# Altium schematic sheet Logger.SchDoc
size A1; SheetNumber: 1; SheetTotal: 4
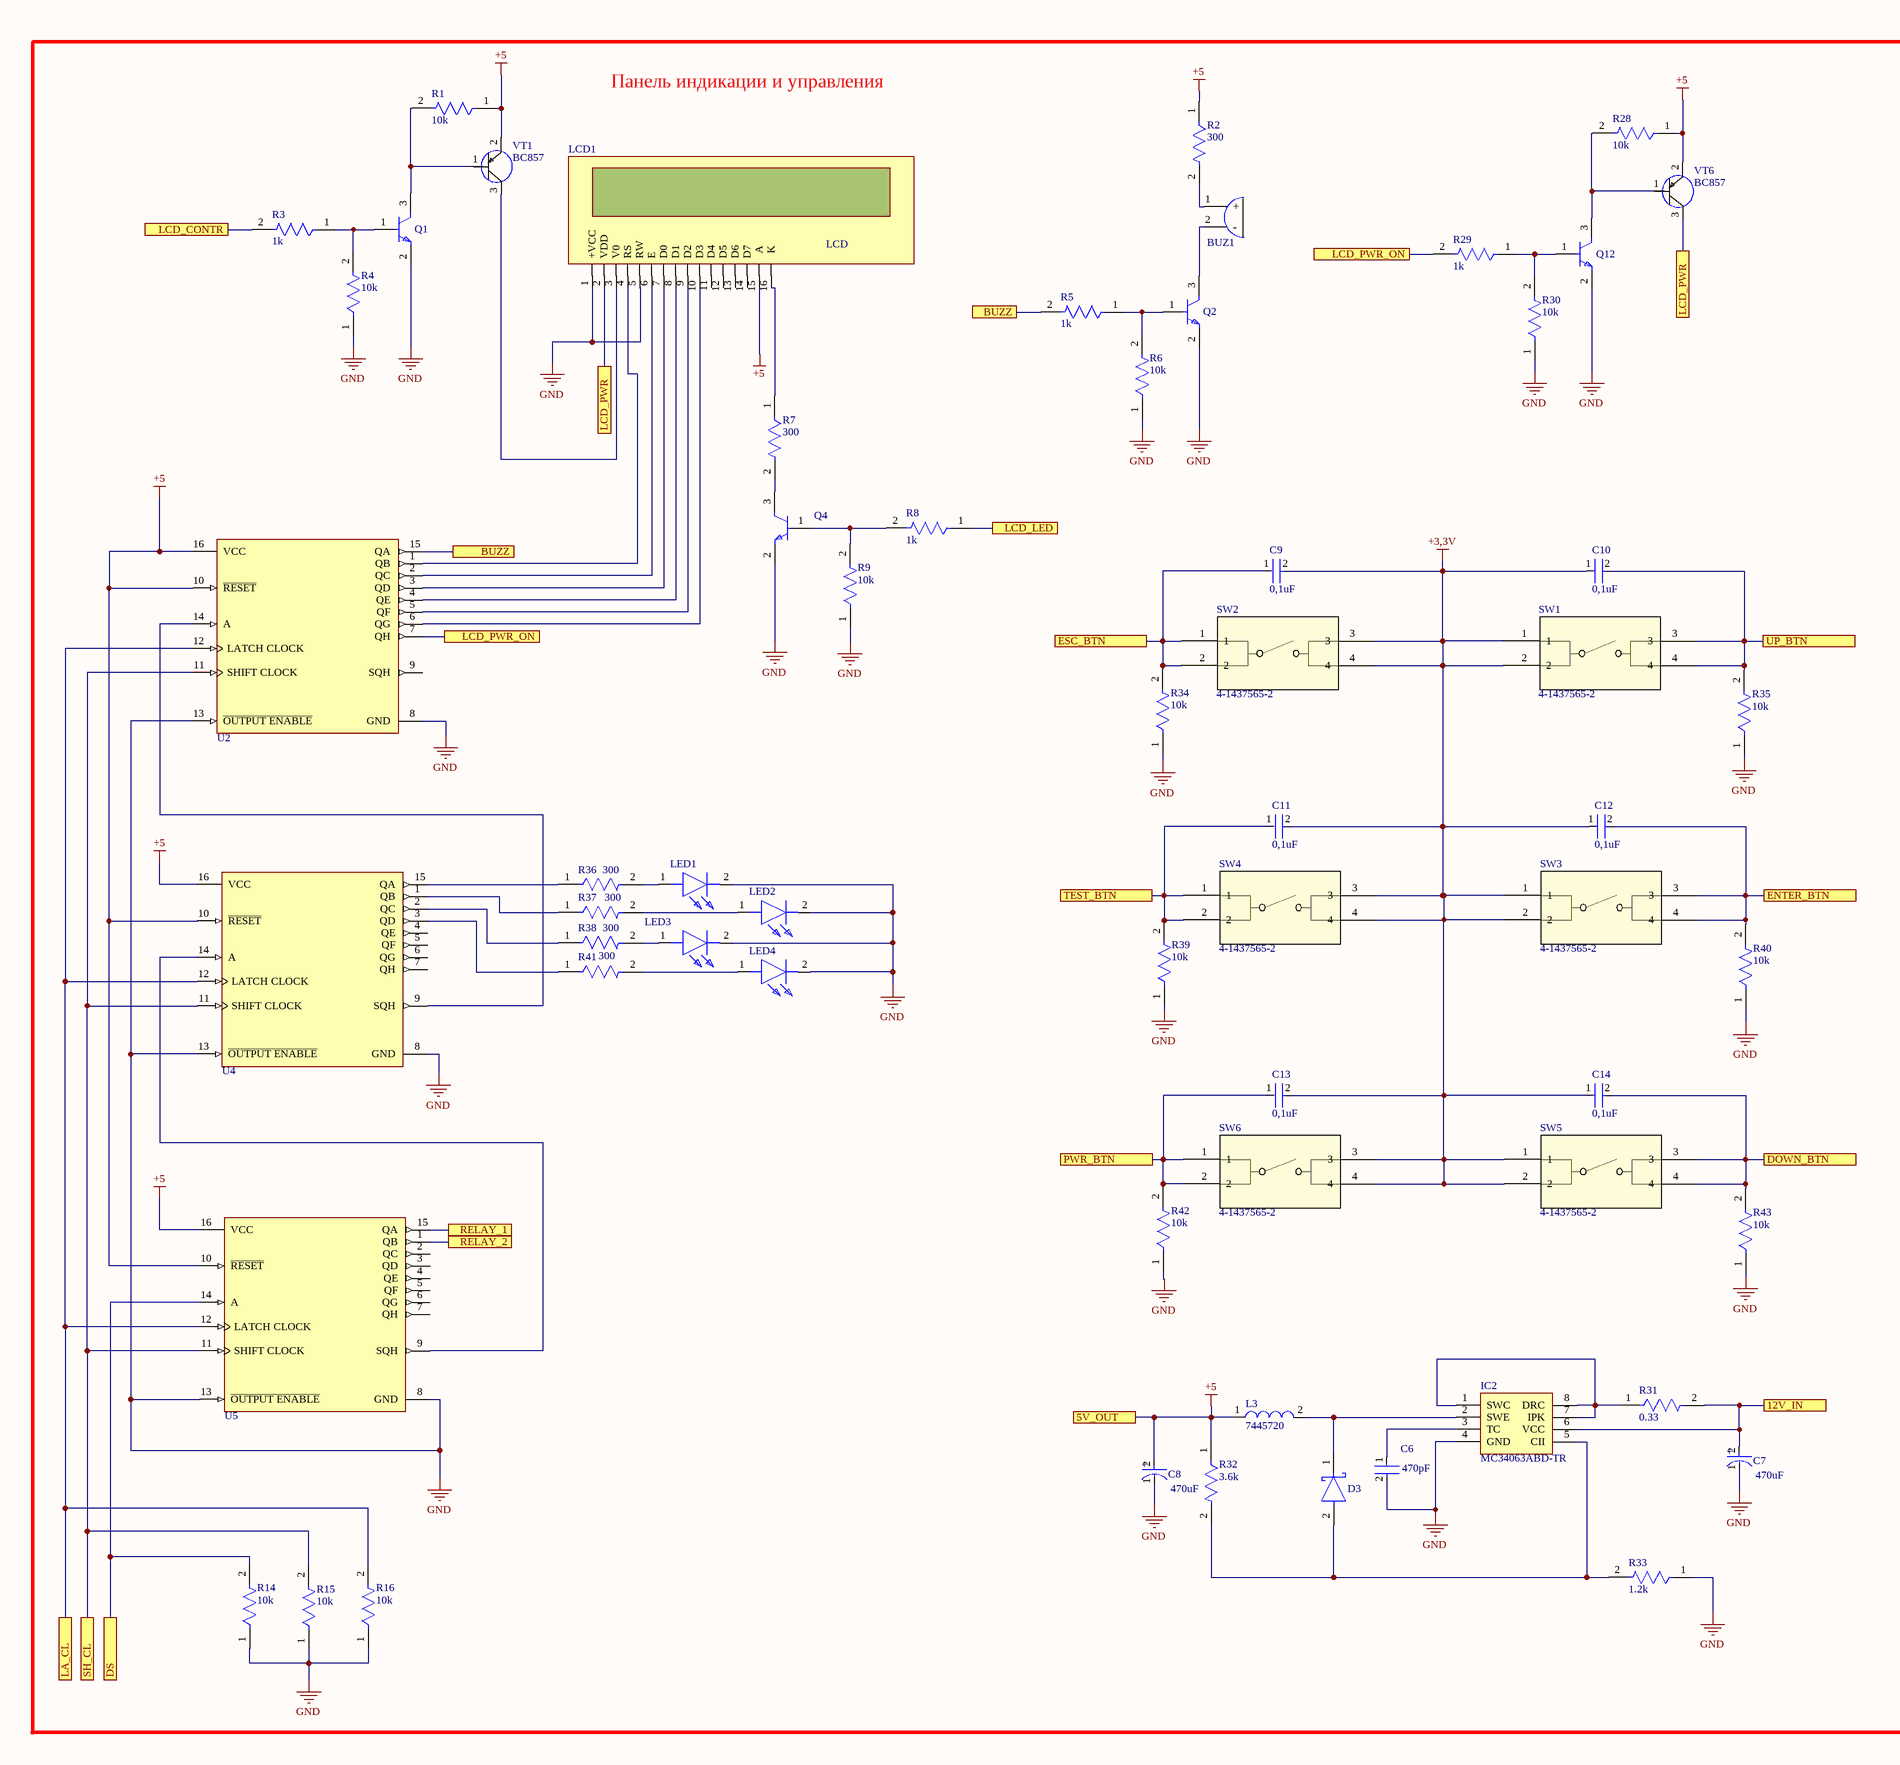
[diagram p0: Logger.SchDoc, left]
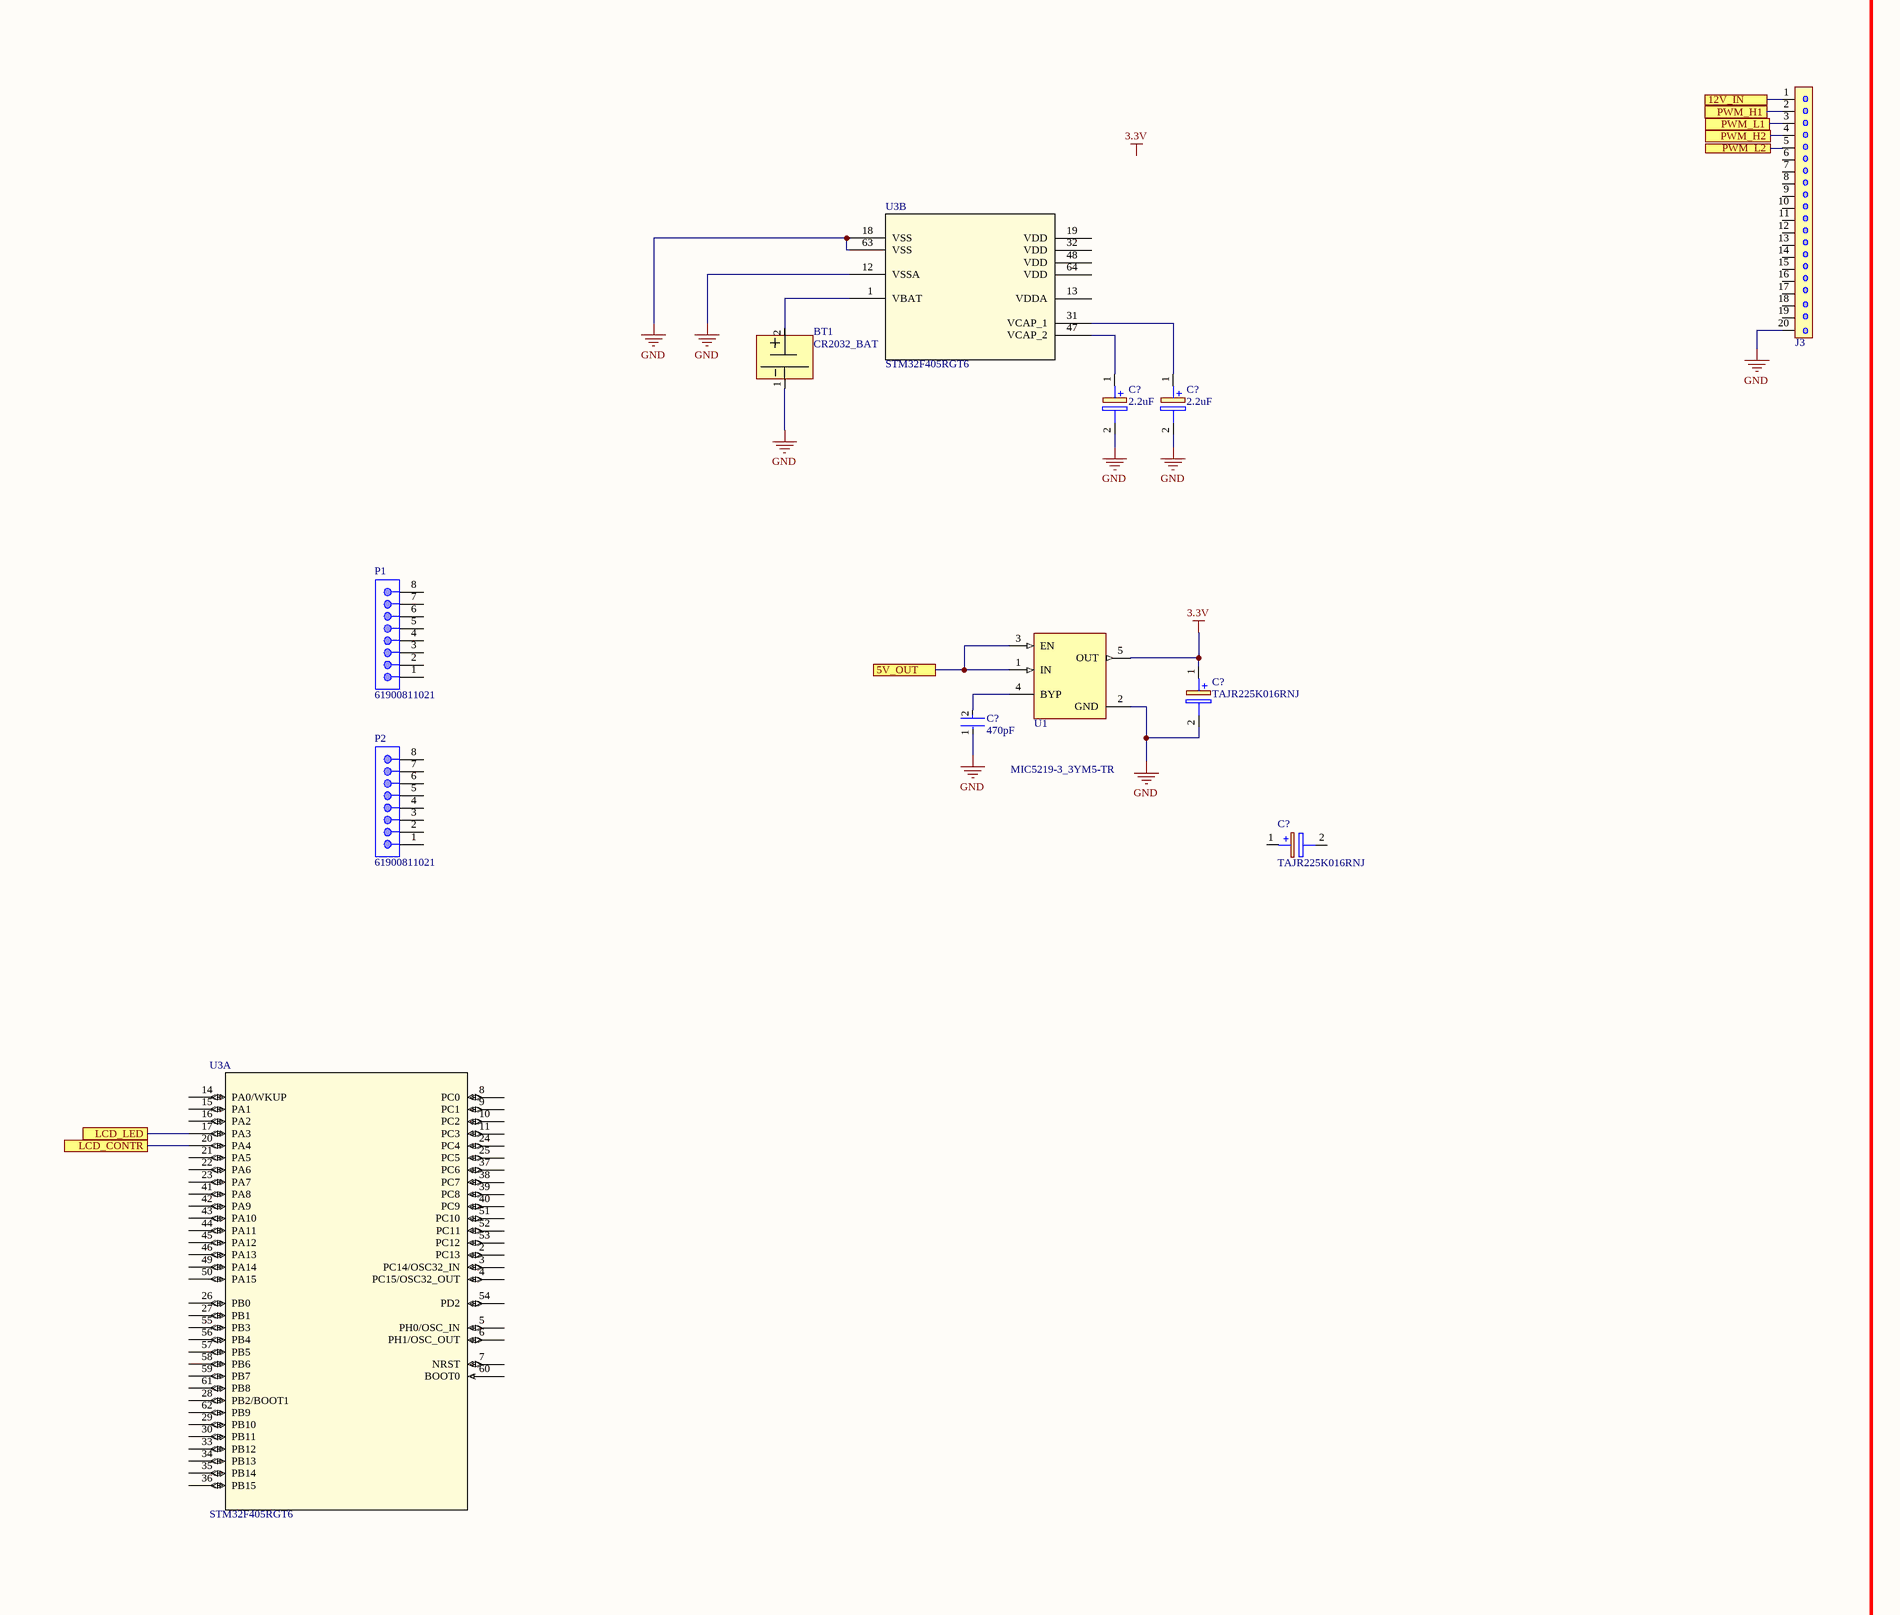
[diagram p1: Logger.SchDoc, right]

## Parts
(Parts that share a designator on the sheet are numbered #1, #2 ... from top to bottom, then left to right.)
BT1  CR2032_BAT  [CR2032_BAT]
BUZ1  BUZZER  [BUZZER]  (value not drawn)
C6  470pF  [KEMET_C0805C-DN_IPC_C]
C7  470uF  [Nichicon_0_MFG]
C8  470uF  [Nichicon_0_MFG]
C9  0,1uF  [KEMET_C0805C-DN_IPC_C]
C10  0,1uF  [KEMET_C0805C-DN_IPC_C]
C11  0,1uF  [KEMET_C0805C-DN_IPC_C]
C12  0,1uF  [KEMET_C0805C-DN_IPC_C]
C13  0,1uF  [KEMET_C0805C-DN_IPC_C]
C14  0,1uF  [KEMET_C0805C-DN_IPC_C]
C?#1  2.2uF  [CAPPM2014X140N]
C?#2  2.2uF  [CAPPM2014X140N]
C?#3  TAJR225K016RNJ  [CAPPM2014X140N]
C?#4  470pF  [KEMET_C0805C-DN_IPC_C]
C?#5  TAJR225K016RNJ  [CAPPM2014X140N]
D3  Diode_Vishay_SS16-E3-61T_eec  [Vishay_SS16-E3-61T_0]  (value not drawn)
IC2  MC34063ABD-TR  [SOIC127P600X175-8N]
J3  20_pin_connector  [20_pin_connector]  (value not drawn)
L3  7445720  [WE-PD2-L]
LCD1  LCD  [LCD20x4]
LED1  151031YS06000  [151031YS06000]  (value not drawn)
LED2  151031YS06000  [151031YS06000]  (value not drawn)
LED3  151031YS06000  [151031YS06000]  (value not drawn)
LED4  151031YS06000  [151031YS06000]  (value not drawn)
P1  61900811021  [61900811021]
P2  61900811021  [61900811021]
Q1  SBC847BLT1G  [On_Semiconductor_318-08_IPC_B]  (value not drawn)
Q2  SBC847BLT1G  [On_Semiconductor_318-08_IPC_B]  (value not drawn)
Q4  SBC847BLT1G  [On_Semiconductor_318-08_IPC_B]  (value not drawn)
Q12  SBC847BLT1G  [On_Semiconductor_318-08_IPC_B]  (value not drawn)
R1  10k  [Vishay_CRCW0805-e3_IPC_A]
R2  300  [Vishay_CRCW0805-e3_IPC_A]
R3  1k  [Vishay_CRCW0805-e3_IPC_A]
R4  10k  [Vishay_CRCW0805-e3_IPC_A]
R5  1k  [Vishay_CRCW0805-e3_IPC_A]
R6  10k  [Vishay_CRCW0805-e3_IPC_A]
R7  300  [Vishay_CRCW0805-e3_IPC_A]
R8  1k  [Vishay_CRCW0805-e3_IPC_A]
R9  10k  [Vishay_CRCW0805-e3_IPC_A]
R14  10k  [Vishay_CRCW0805-e3_IPC_A]
R15  10k  [Vishay_CRCW0805-e3_IPC_A]
R16  10k  [Vishay_CRCW0805-e3_IPC_A]
R28  10k  [Vishay_CRCW0805-e3_IPC_A]
R29  1k  [Vishay_CRCW0805-e3_IPC_A]
R30  10k  [Vishay_CRCW0805-e3_IPC_A]
R31  0.33  [Vishay_CRCW0805-e3_IPC_A]
R32  3.6k  [Vishay_CRCW0805-e3_IPC_A]
R33  1.2k  [Vishay_CRCW0805-e3_IPC_A]
R34  10k  [Vishay_CRCW0805-e3_IPC_A]
R35  10k  [Vishay_CRCW0805-e3_IPC_A]
R36  300  [Vishay_CRCW0805-e3_IPC_A]
R37  300  [Vishay_CRCW0805-e3_IPC_A]
R38  300  [Vishay_CRCW0805-e3_IPC_A]
R39  10k  [Vishay_CRCW0805-e3_IPC_A]
R40  10k  [Vishay_CRCW0805-e3_IPC_A]
R41  300  [Vishay_CRCW0805-e3_IPC_A]
R42  10k  [Vishay_CRCW0805-e3_IPC_A]
R43  10k  [Vishay_CRCW0805-e3_IPC_A]
SW1  4-1437565-2  [SW4_FSM-5P23_TEC]
SW2  4-1437565-2  [SW4_FSM-5P23_TEC]
SW3  4-1437565-2  [SW4_FSM-5P23_TEC]
SW4  4-1437565-2  [SW4_FSM-5P23_TEC]
SW5  4-1437565-2  [SW4_FSM-5P23_TEC]
SW6  4-1437565-2  [SW4_FSM-5P23_TEC]
U1  MIC5219-3_3YM5-TR  [Microchip_SOT23-5LD-PL-1_MFG]
U2  MC74HC595ADG  [On_Semiconductor_751B-05_MFG]  (value not drawn)
U3  STM32F405RGT6  [LQFP64-10x10mm]  (parts A,B of 2)
U4  MC74HC595ADG  [On_Semiconductor_751B-05_IPC_B]  (value not drawn)
U5  MC74HC595ADG  [On_Semiconductor_751B-05_IPC_B]  (value not drawn)
VT1  BC857  [On_Semiconductor_318-08_IPC_C]
VT6  BC857  [On_Semiconductor_318-08_IPC_C]

## Blocks framed on the sheet
Панель индикации и управления: BT1 BUZ1 C6-C14 C?#1-C?#5 D3 IC2 J3 L3 LCD1 LED1-LED4 P1 P2 Q1 Q2 Q4 Q12 R1-R9 R14-R16 R28-R43 SW1-SW6 U1-U5 VT1 VT6

## Ports
5V_OUT, 12V_IN, BUZZ, DOWN_BTN, DS, ENTER_BTN, ESC_BTN, LA_CL, LCD_CONTR, LCD_LED, LCD_PWR, LCD_PWR_ON, PWM_H1, PWM_H2, PWM_L1, PWM_L2, PWR_BTN, RELAY_1, RELAY_2, SH_CL, TEST_BTN, UP_BTN

## Nets
3.3V: C?#3.1(+) U1.5(OUT)
+3,3V: C9.2 C10.1 C11.2 C12.1 C13.2 C14.1 SW1.1 SW1.2 SW2.3 SW2.4 SW3.1 SW3.2 SW4.3 SW4.4 SW5.1 SW5.2 SW6.3 SW6.4
+5: C8.2(A) L3.1 LCD1.15(A) R1.1 R2.1 R28.1 R32.1 U1.1(IN) U1.3(EN) U2.10(~{RESET}) U2.16(VCC) U4.10(~{RESET}) U4.16(VCC) U5.10(~{RESET}) U5.16(VCC) VT1.2(E) VT6.2(E) ; port 5V_OUT
GND: BT1.1(-) C6.2 C7.1(C) C8.1(C) C?#1.2(-) C?#2.2(-) C?#3.2(-) C?#4.1 IC2.4(GND) J3.20 LCD1.1(+VCC) LCD1.5(RW) LED1.2(K) LED2.2(K) LED3.2(K) LED4.2(K) Q1.2(E) Q2.2(E) Q4.2(E) Q12.2(E) R4.1 R6.1 R9.1 R14.1 R15.1 R16.1 R30.1 R33.1 R34.1 R35.1 R39.1 R40.1 R42.1 R43.1 U1.2(GND) U2.8(GND) U2.13(~{OUTPUT_ENABLE}) U3.12(VSSA) U3.18(VSS) U3.63(VSS) U4.8(GND) U4.13(~{OUTPUT_ENABLE}) U5.8(GND) U5.13(~{OUTPUT_ENABLE})
12V_IN: C7.2(A) IC2.6(VCC) J3.1 R31.2 ; port 12V_IN
BUZZ: R5.2 U2.15(QA) ; port BUZZ
DOWN_BTN: C14.2 R43.2 SW5.3 SW5.4 ; port DOWN_BTN
DS: R14.2 U5.14(A) ; port DS
ENTER_BTN: C12.2 R40.2 SW3.3 SW3.4 ; port ENTER_BTN
ESC_BTN: C9.1 R34.2 SW2.1 SW2.2 ; port ESC_BTN
LA_CL: R16.2 U2.12(LATCH_CLOCK) U4.12(LATCH_CLOCK) U5.12(LATCH_CLOCK) ; port LA_CL
LCD_CONTR: R3.2 U3.20(PA4) ; port LCD_CONTR
LCD_LED: R8.1 U3.17(PA3) ; port LCD_LED
LCD_PWR: LCD1.2(VDD) VT6.3(C) ; port LCD_PWR
LCD_PWR_ON: R29.2 U2.7(QH) ; port LCD_PWR_ON
PWM_H1: J3.2 ; port PWM_H1
PWM_H2: J3.4 ; port PWM_H2
PWM_L1: J3.3 ; port PWM_L1
PWM_L2: J3.5 ; port PWM_L2
PWR_BTN: C13.1 R42.2 SW6.1 SW6.2 ; port PWR_BTN
RELAY_1: U5.15(QA) ; port RELAY_1
RELAY_2: U5.1(QB) ; port RELAY_2
SH_CL: R15.2 U2.11(SHIFT_CLOCK) U4.11(SHIFT_CLOCK) U5.11(SHIFT_CLOCK) ; port SH_CL
TEST_BTN: C11.1 R39.2 SW4.1 SW4.2 ; port TEST_BTN
UP_BTN: C10.2 R35.2 SW1.3 SW1.4 ; port UP_BTN
NetBT1_2: BT1.2(+) U3.1(VBAT)
NetBUZ1_1: BUZ1.1(+) R2.2
NetBUZ1_2: BUZ1.2(-) Q2.3(C)
NetC6_1: C6.1 IC2.3(TC)
NetC?#1_1: C?#1.1(+) U3.47(VCAP_2)
NetC?#2_1: C?#2.1(+) U3.31(VCAP_1)
NetC?#4_2: C?#4.2 U1.4(BYP)
NetD3_1: D3.1(C) IC2.2(SWE) L3.2
NetD3_2: D3.2(A) IC2.5(CII) R32.2 R33.2
NetIC2_1: IC2.1(SWC) IC2.7(IPK) IC2.8(DRC) R31.1
NetLCD1_3: LCD1.3(V0) VT1.3(C)
NetLCD1_4: LCD1.4(RS) U2.1(QB)
NetLCD1_6: LCD1.6(E) U2.2(QC)
NetLCD1_7: LCD1.7(D0) U2.3(QD)
NetLCD1_8: LCD1.8(D1) U2.4(QE)
NetLCD1_9: LCD1.9(D2) U2.5(QF)
NetLCD1_10: LCD1.10(D3) U2.6(QG)
NetLCD1_16: LCD1.16(K) R7.1
NetLED1_1: LED1.1(A) R36.2
NetLED2_1: LED2.1(A) R37.2
NetLED3_1: LED3.1(A) R38.2
NetLED4_1: LED4.1(A) R41.2
NetQ1_1: Q1.1(B) R3.1 R4.2
NetQ1_3: Q1.3(C) R1.2 VT1.1(B)
NetQ2_1: Q2.1(B) R5.1 R6.2
NetQ4_1: Q4.1(B) R8.2 R9.2
NetQ4_3: Q4.3(C) R7.2
NetQ12_1: Q12.1(B) R29.1 R30.2
NetQ12_3: Q12.3(C) R28.2 VT6.1(B)
NetR36_1: R36.1 U4.15(QA)
NetR37_1: R37.1 U4.1(QB)
NetR38_1: R38.1 U4.2(QC)
NetR41_1: R41.1 U4.3(QD)
NetU2_14: U2.14(A) U4.9(SQH)
NetU4_14: U4.14(A) U5.9(SQH)

Not connected (* = marked no-connect by the designer): C?#5 1(+) 2(-); J3 6 7 8 9 10 11 12 13 14 15 16 17 18 19; LCD1 11(D4) 12(D5) 13(D6) 14(D7); P1 1 2 3 4 5 6 7 8; P2 1 2 3 4 5 6 7 8; U2 9(SQH); U3 2(PC13) 3(PC14/OSC32_IN) 4(PC15/OSC32_OUT) 5(PH0/OSC_IN) 6(PH1/OSC_OUT) 7(NRST) 8(PC0) 9(PC1) 10(PC2) 11(PC3) 13(VDDA) 14(PA0/WKUP) 15(PA1) 16(PA2) 19(VDD) 21(PA5) 22(PA6) 23(PA7) 24(PC4) 25(PC5) 26(PB0) 27(PB1) 28(PB2/BOOT1) 29(PB10) 30(PB11) 32(VDD) 33(PB12) 34(PB13) 35(PB14) 36(PB15) 37(PC6) 38(PC7) 39(PC8) 40(PC9) 41(PA8) 42(PA9) 43(PA10) 44(PA11) 45(PA12) 46(PA13) 48(VDD) 49(PA14) 50(PA15) 51(PC10) 52(PC11) 53(PC12) 54(PD2) 55(PB3) 56(PB4) 57(PB5) 58(PB6) 59(PB7) 60(BOOT0) 61(PB8) 62(PB9) 64(VDD); U4 4(QE) 5(QF) 6(QG) 7(QH); U5 2(QC) 3(QD) 4(QE) 5(QF) 6(QG) 7(QH)

## Notes on the sheet
- Labels drawn without touching a wire or pin: 3.3V
- (in symbol UWX1E101MCL1GB) +

## Library data of the parts
C6 C9-C14 C?#4 = C0805C104J4RACTU
C7 C8 = UWX1E101MCL1GB
C?#1-C?#3 C?#5 = TAJR225K016RNJ: Capacitor Polarised; Manufacturer_Name: AVX; Datasheet Link: http://www.farnell.com/datasheets/1680476.pdf; Height: 1.2mm; Manufacturer_Part_Number: TAJR225K016RNJ; Mouser Part Number: 581-TAJR225K016RNJ; Mouser Price/Stock: https://www.mouser.co.uk/ProductDetail/AVX/TAJR225K016RNJ/?qs=vQJa%252BfcOt8MJtnsQ1zkKAg%3D%3D; Arrow Part Number: TAJR225K016RNJ; Arrow Price/Stock: https://www.arrow.com/en/products/tajr225k016rnj/avx
D3 = Diode_Vishay_SS16-E3-61T_eec: Diode Schottky 60V 1A Surface Mount DO-214AC (SMA); Part Number: SS16-E3/61T; Manufacturer: Vishay; Voltage - Forward (Vf) (Max) @ If: 750mV @ 1A; Current - Reverse Leakage @ Vr: 200µA @ 60V; helpURL: https://upverter.com/upn/revision/46fb9ccadf7e3052/; ComponentLink2Description: Datasheet; Temperature: -65°C to +150°C; Package: DO-214AC; Supplier 2: Mouser; Price: 0.180579591464; Supplier 1: Digi-Key; ComponentLink1URL: https://upverter.com/upn/revision/46fb9ccadf7e3052/; Supplier Part Number 2: 625-SS16-E3; Supplier Part Number 1: SS16-E3/61TGICT-ND; ComponentLink1Description: Upverter; ComponentLink2URL: http://www.vishay.com/docs/88746/ss12.pdf; RoHS: TRUE; Mouser Part Number: 625-SS16-E3; Temperature Range High: +150°C; Digikey Description: Diode Schottky 60V 1A Surface Mount DO-214AC (SMA); Digikey Part Number: SS16-E3/61TGICT-ND; Current - Average Rectified (Io): 1A; Lead Free: yes; Voltage - DC Reverse (Vr) (Max): 60V; Temperature Range Low: -65°C
IC2 = MC34063ABD-TR: Integrated Circuit; Manufacturer_Name: STMicroelectronics; Datasheet Link: http://www.st.com/st-web-ui/static/active/en/resource/technical/document/datasheet/CD00001232.pdf; Height: 1.75mm; Manufacturer_Part_Number: MC34063ABD-TR; Mouser Part Number: 511-MC34063ABD-TR; Mouser Price/Stock: https://www.mouser.co.uk/ProductDetail/STMicroelectronics/MC34063ABD-TR?qs=PGXP4M47uW4YbbaNPuFQGA%3D%3D; Arrow Part Number: MC34063ABD-TR; Arrow Price/Stock: https://www.arrow.com/en/products/mc34063abd-tr/stmicroelectronics?region=nac
J3 = 20_pin_connector: 20_pin 2.54mm connector
L3 = 7445720: SMD-Power Inductor WE-PD4, L = 100 µH; Inductance: 100 ÂµH; ComponentLink1Description: Manufacturer Link; ComponentLink2Description: Datasheet; DatasheetVersion: ver 1, Oct-2004; ComponentLink1URL: http://www.we-online.com; PackageVersion: 2004; PackageDescription: SMD Inductor, 2-Leads, Body 22.0 x 15.0 mm; ComponentLink2URL: http://www.we-online.de/katalog/media/pdf/7445720.pdf; PackageReference: WE-PD4-XL; PartNumber: 7445720
LCD1 = LCD: 20x4
LED1-LED4 = 151031YS06000: LED; Manufacturer_Name: Wurth Elektronik; Datasheet Link: https://katalog.we-online.de/led/datasheet/151031YS06000.pdf; Height: 5.5mm; Manufacturer_Part_Number: 151031YS06000; Mouser Part Number: 710-151031YS06000; Mouser Price/Stock: https://www.mouser.co.uk/ProductDetail/Wurth-Elektronik/151031YS06000?qs=LlUlMxKIyB3xSYYW%252BcuBiQ%3D%3D
P1 P2 = 61900811021: WR-WTB THT Male Left Angled Bottom Locking Header, pitch 2.54mm, 8p; Pin Number: 8; Contact Resistance: 20mOhm; Rated Current: 3A; Withstanding Voltage: 1000VAC; Working Voltage: 250VAC; ComponentLink1Description: Manufacturer; ComponentLink1URL: http://www.we-online.de; ComponentLink2Description: Datasheet; ComponentLink2URL: https://www.we-online.com/catalog/datasheet/61900811021.pdf; Pitch: 2.54mm; Published Date: January 2020; Publisher: Wurth Elektronik; Mounting Technology: THT; Packaging: Bag; Operating Temperature: -40 to +105degC; Part Number: 61900811021; Gender: Male; Type: Right Angled Bottom Locking
R1-R9 R14-R16 R28-R43 = CRCW08050000Z0EA: 100k: *
SW1-SW6 = 4-1437565-2: No Description Available; Mfr_Name: TE Connectivity; Copyright: Copyright (C) 2022 Ultra Librarian. All rights reserved.; Manufacturer_Part_Number: 4-1437565-2; RefDes: RefDes; Type: DEV
U3 = STM32F405RGT6: No Description Available; Mfr_Name: STMicroelectronics; Copyright: Copyright (C) 2022 Ultra Librarian. All rights reserved.; Manufacturer_Part_Number: STM32F405RGT6; RefDes: RefDes; Type: DEV